# EAGLE schematic U WE BOX (EAGLE 9.6.2)

## Sheet 1 of 6: Power Supply Unit
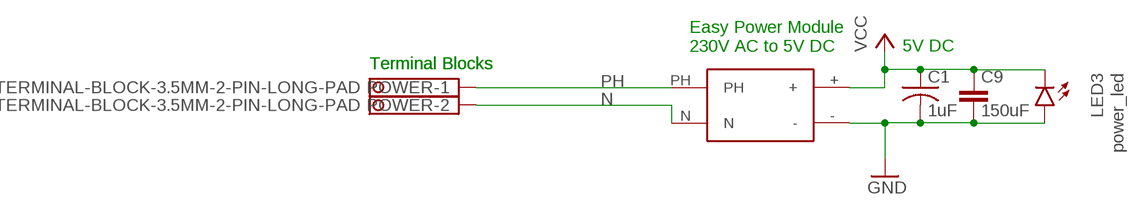
[diagram p0: schematic, sheet 1]

### Parts
C1  1uF  C-USC1206K  [C1206K]
C9  150uF  C5/5  [C5B5]
LED3  power_led  LEDCHIPLED_1206  [CHIPLED_1206]
POWER  TERMINAL-BLOCK-3.5MM-2-PIN-LONG-PAD  [TERMINAL-BLOCK-2-PIN-3.5MM-LONG-PAD]
U2  AC/DCCONVERTER  [ACDC]

### Nets
GND: C1.2 C9.2 LED3.A U2.- ; also sheet 2,3,4,5,6
N: POWER.2 U2.N ; also sheet 5
PH: POWER.1 U2.PH ; also sheet 5
VCC: C1.1 C9.1 LED3.C U2.+ ; also sheet 2,3,4,5,6

### Notes on the sheet
- Easy Power Module
  230V AC to 5V DC
- 5V DC
- Terminal Blocks | Terminal Blocks

## Sheet 2 of 6: Indication LEDs
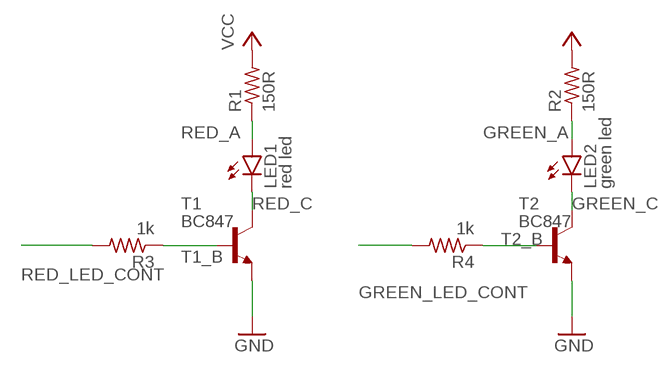
[diagram p1: schematic, sheet 2]

### Parts
LED1  red led  LEDCHIPLED_1206  [CHIPLED_1206]
LED2  green led  LEDCHIPLED_1206  [CHIPLED_1206]
R1  150R  R-US_R1206  [R1206]
R2  150R  R-US_R1206  [R1206]
R3  1k  R-US_R1206  [R1206]
R4  1k  R-US_R1206  [R1206]
T1  BC847  [SOT23]
T2  BC847  [SOT23]

### Nets
GND: T1.2(E) T2.2(E) ; also sheet 1,3,4,5,6
GREEN_A: LED2.A R2.1
GREEN_C: LED2.C T2.3(C)
GREEN_LED_CONT: R4.2 ; also sheet 6
RED_A: LED1.A R1.1
RED_C: LED1.C T1.3(C)
RED_LED_CONT: R3.2 ; also sheet 6
T1_B: R3.1 T1.1(B)
T2_B: R4.1 T2.1(B)
VCC: R1.2 R2.2 ; also sheet 1,3,4,5,6

## Sheet 3 of 6: Hooter System
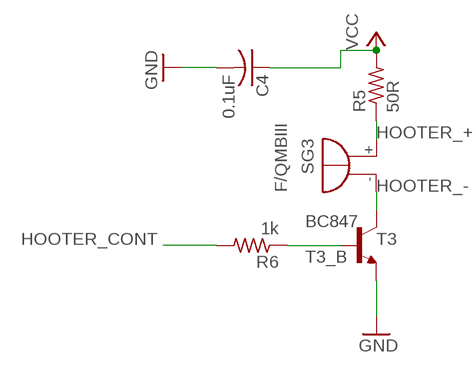
[diagram p2: schematic, sheet 3]

### Parts
C4  0.1uF  C-USC1206K  [C1206K]
R5  50R  R-US_R1206  [R1206]
R6  1k  R-US_R1206  [R1206]
SG3  F/QMBIII  [F/QMBIII]
T3  BC847  [SOT23]

### Nets
GND: C4.2 T3.2(E) ; also sheet 1,2,4,5,6
HOOTER_+: R5.1 SG3.+(-)
HOOTER_-: SG3.-(+) T3.3(C)
HOOTER_CONT: R6.2 ; also sheet 6
T3_B: R6.1 T3.1(B)
VCC: C4.1 R5.2 ; also sheet 1,2,4,5,6

## Sheet 4 of 6: Pushbutton
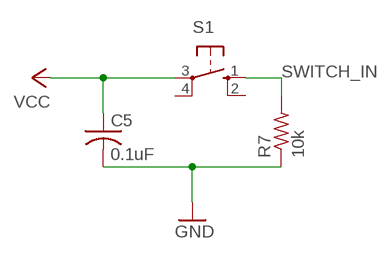
[diagram p3: schematic, sheet 4]

### Parts
C5  0.1uF  C-USC1206K  [C1206K]
R7  10k  R-US_R1206  [R1206]
S1  40-XX  [B3F-40XX]

### Nets
GND: C5.2 R7.1 ; also sheet 1,2,3,5,6
SWITCH_IN: R7.2 S1.1(S) ; also sheet 6
VCC: C5.1 S1.3(P) ; also sheet 1,2,3,5,6
Unconnected: S1.2(S1) S1.4(P1)

## Sheet 5 of 6: Relay and Limit Switch
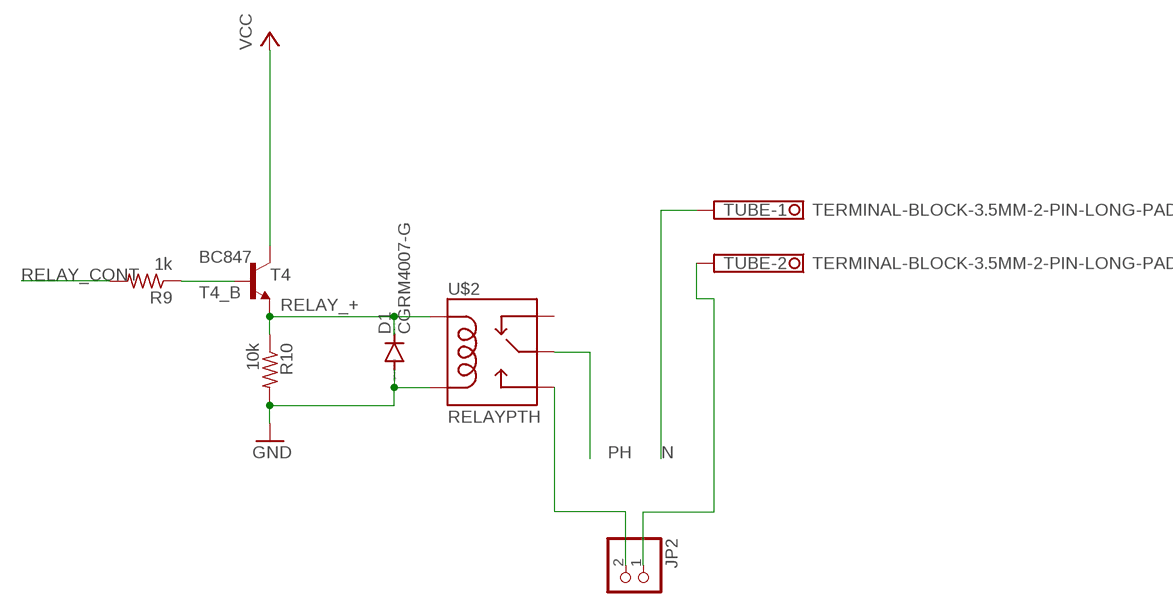
[diagram p4: schematic, sheet 5]

### Parts
D1  CGRM4007-G  [SOD-123_MINI-SMA]
JP2  PINHD-1X2  [1X02]
R9  1k  R-US_R1206  [R1206]
R10  10k  R-US_R1206  [R1206]
T4  BC847  [SOT23]
TUBE  TERMINAL-BLOCK-3.5MM-2-PIN-LONG-PAD  [TERMINAL-BLOCK-2-PIN-3.5MM-LONG-PAD]
U$2  RELAYPTH  [SRD-05VDC-SL-C]

### Nets
GND: D1.A R10.2 U$2.COIL0 ; also sheet 1,2,3,4,6
N: TUBE.1 ; also sheet 1
N$1: JP2.2 U$2.SWOPEN
PH: U$2.SWCOMMON ; also sheet 1
RELAY_+: D1.C R10.1 T4.2(E) U$2.COIL1
RELAY_CONT: R9.2 ; also sheet 6
T4_B: R9.1 T4.1(B)
TUBE_N: JP2.1 TUBE.2
VCC: T4.3(C) ; also sheet 1,2,3,4,6
Unconnected: U$2.SWCLOSED(SWCLOSE)

## Sheet 6 of 6: controller
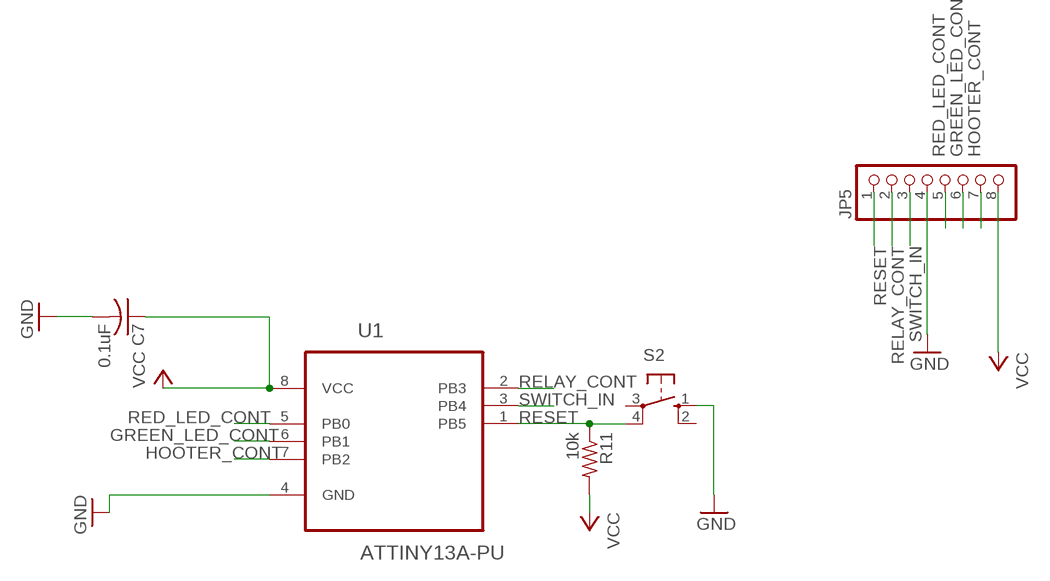
[diagram p5: schematic, sheet 6]

### Parts
C7  0.1uF  C-USC1206K  [C1206K]
JP5  PINHD-1X8  [1X08]
R11  10k  R-US_R1206  [R1206]
S2  10-XX  [B3F-10XX]
U1  ATTINY13A-PU  [DIP254P762X533-8]

### Nets
GND: C7.2 JP5.4 S2.1(S) U1.4(GND) ; also sheet 1,2,3,4,5
GREEN_LED_CONT: JP5.6 U1.6(PB1) ; also sheet 2
HOOTER_CONT: JP5.7 U1.7(PB2) ; also sheet 3
RED_LED_CONT: JP5.5 U1.5(PB0) ; also sheet 2
RELAY_CONT: JP5.2 U1.2(PB3) ; also sheet 5
RESET: JP5.1 R11.1 S2.4(P1) U1.1(PB5)
SWITCH_IN: JP5.3 U1.3(PB4) ; also sheet 4
VCC: C7.1 JP5.8 R11.2 U1.8(VCC) ; also sheet 1,2,3,4,5
Unconnected: S2.2(S1) S2.3(P)

## Library data of the parts
C1 C4 C5 C7 = rcl:C-US: CAPACITOR, American symbol; SPICEPREFIX: C
C9 = capacitor-wima:C: CAPACITOR naming: grid - package width
D1 = diode:CGRM400*-G: Molded plasitc,JEDEC SOD-123/Mini SMA Source: Comchip CGRM4001-G.pdf
JP2 = pinhead:PINHD-1X2: PIN HEADER
JP5 = pinhead:PINHD-1X8: PIN HEADER
LED1-LED3 = led:LED: LED OSRAM: - CHIPLED LG R971, LG N971, LY N971, LG Q971, LY Q971, LO R971, LY R971 LH N974, LH R974 LS Q976, LO Q976, LY Q976 LO Q996 - Hyper CHIPLED LW Q18S LB Q993, LB Q99A, LB R99A - SideLED LS A670, LO A670, LY A670, LG A670, LP A670 LB A673, LV A673, LT A673, LW A673 LH A674 LY A675 LS A676, LA A676, LO A676, LY A676, LW A676 LS A679, LY A679, LG A679 - Hyper Micro SIDELED® LS Y876, LA Y876, LO Y876, LY Y876 LT Y87S - SmartLED LW L88C, LW L88S LB L89C, LB L89S, LG L890 LS L89K, LO L89K, LY L89K LS L896, LA L896, LO L896, LY L896 - TOPLED LS T670, LO T670, LY T670, LG T670, LP T670 LSG T670, LSP T670, LSY T670, LOP T670, LYG T670 LG T671, LOG T671, LSG T671 LB T673, LV T673, LT T673, LW T673 LH T674 LS T676, LA T676, LO T676, LY T676, LB T676, LH T676, LSB T676, LW T676 LB T67C, LV T67C, LT T67C, LS T67K, LO T67K, LY T67K, LW E67C LS E67B, LA E67B, LO E67B, LY E67B, LB E67C, LV E67C, LT E67C LW T67C LS T679, LY T679, LG T679 LS T770, LO T770, LY T770, LG T770, LP T770 LB T773, LV T773, LT T773, LW T773 LH T774 LS E675, LA E675, LY E675, LS T675 LS T776, LA T776, LO T776, LY T776, LB T776 LHGB T686 LT T68C, LB T68C - Hyper Mini TOPLED® LB M676 - Mini TOPLED Santana® LG M470 LS M47K, LO M47K, LY M47K Source: http://www.osram.convergy.de LUXEON: - LUMILED® LXK2-PW12-R00, LXK2-PW12-S00, LXK2-PW14-U00, LXK2-PW14-V00 LXK2-PM12-R00, LXK2-PM12-S00, LXK2-PM14-U00 LXK2-PE12-Q00, LXK2-PE12-R00, LXK2-PE12-S00, LXK2-PE14-T00, LXK2-PE14-U00 LXK2-PB12-K00, LXK2-PB12-L00, LXK2-PB12-M00, LXK2-PB14-N00, LXK2-PB14-P00, LXK2-PB14-Q00 LXK2-PR12-L00, LXK2-PR12-M00, LXK2-PR14-Q00, LXK2-PR14-R00 LXK2-PD12-Q00, LXK2-PD12-R00, LXK2-PD12-S00 LXK2-PH12-R00, LXK2-PH12-S00 LXK2-PL12-P00, LXK2-PL12-Q00, LXK2-PL12-R00 Source: www.luxeon.com KINGBRIGHT: KA-3528ASYC Source: www.kingbright.com
POWER TUBE = Rembrandt Electronics - Terminal Block 3-5mm v1-0:TERMINAL-BLOCK-3.5MM-2-PIN: Terminal Block 3.5mm Pitch: 3,5 mm Number of pins: 2 Created by Rembrandt Electronics www.rembrandtelectronics.com
R1-R7 R9-R11 = rcl:R-US_: RESISTOR, American symbol; SPICEPREFIX: R
S1 = switch-omron:40-XX: OMRON SWITCH; MF: OMRON COMPONENTS USA; MPN: B3F-4000; OC_FARNELL: 176434; OC_NEWARK: 36K3105
S2 = switch-omron:10-XX: OMRON SWITCH; MPN: B3F-1000; OC_FARNELL: 176432; OC_NEWARK: 36M3542
SG3 = buzzer:F/QMBIII: BUZZER Source: Buerklin; OC_FARNELL: unknown; OC_NEWARK: unknown
T1-T4 = transistor:BC847: NPN TRANSISTOR
U1 = ATTINY13A-PU:ATTINY13A-PU: 8-bit Microcontroller with 1K Bytes In-System Programmable Flash Check prices <https://pricing.snapeda.com/parts/ATTINY13A-PU/Microchip/view-part?ref=eda>; AVAILABILITY: Good; DESCRIPTION: AVR AVR® ATtiny Microcontroller IC 8-Bit 20MHz 1KB (512 x 16) FLASH 8-PDIP; MF: Microchip; MP: ATTINY13A-PU; PACKAGE: PDIP-8 Microchip; PRICE: None; PURCHASE-URL: https://pricing.snapeda.com/search/part/ATTINY13A-PU/?ref=eda
U2 = ACDC_5V:AC/DCCONVERTER
U$2 = SRD-05VDC-SL-C:RELAY: SPDT relay (COM-00101)

## Net classes
0 default: width 0.152 mm, clearance 0.152 mm